# EasyEDA Pro project STM Embedded BD.eprj, board PCB1
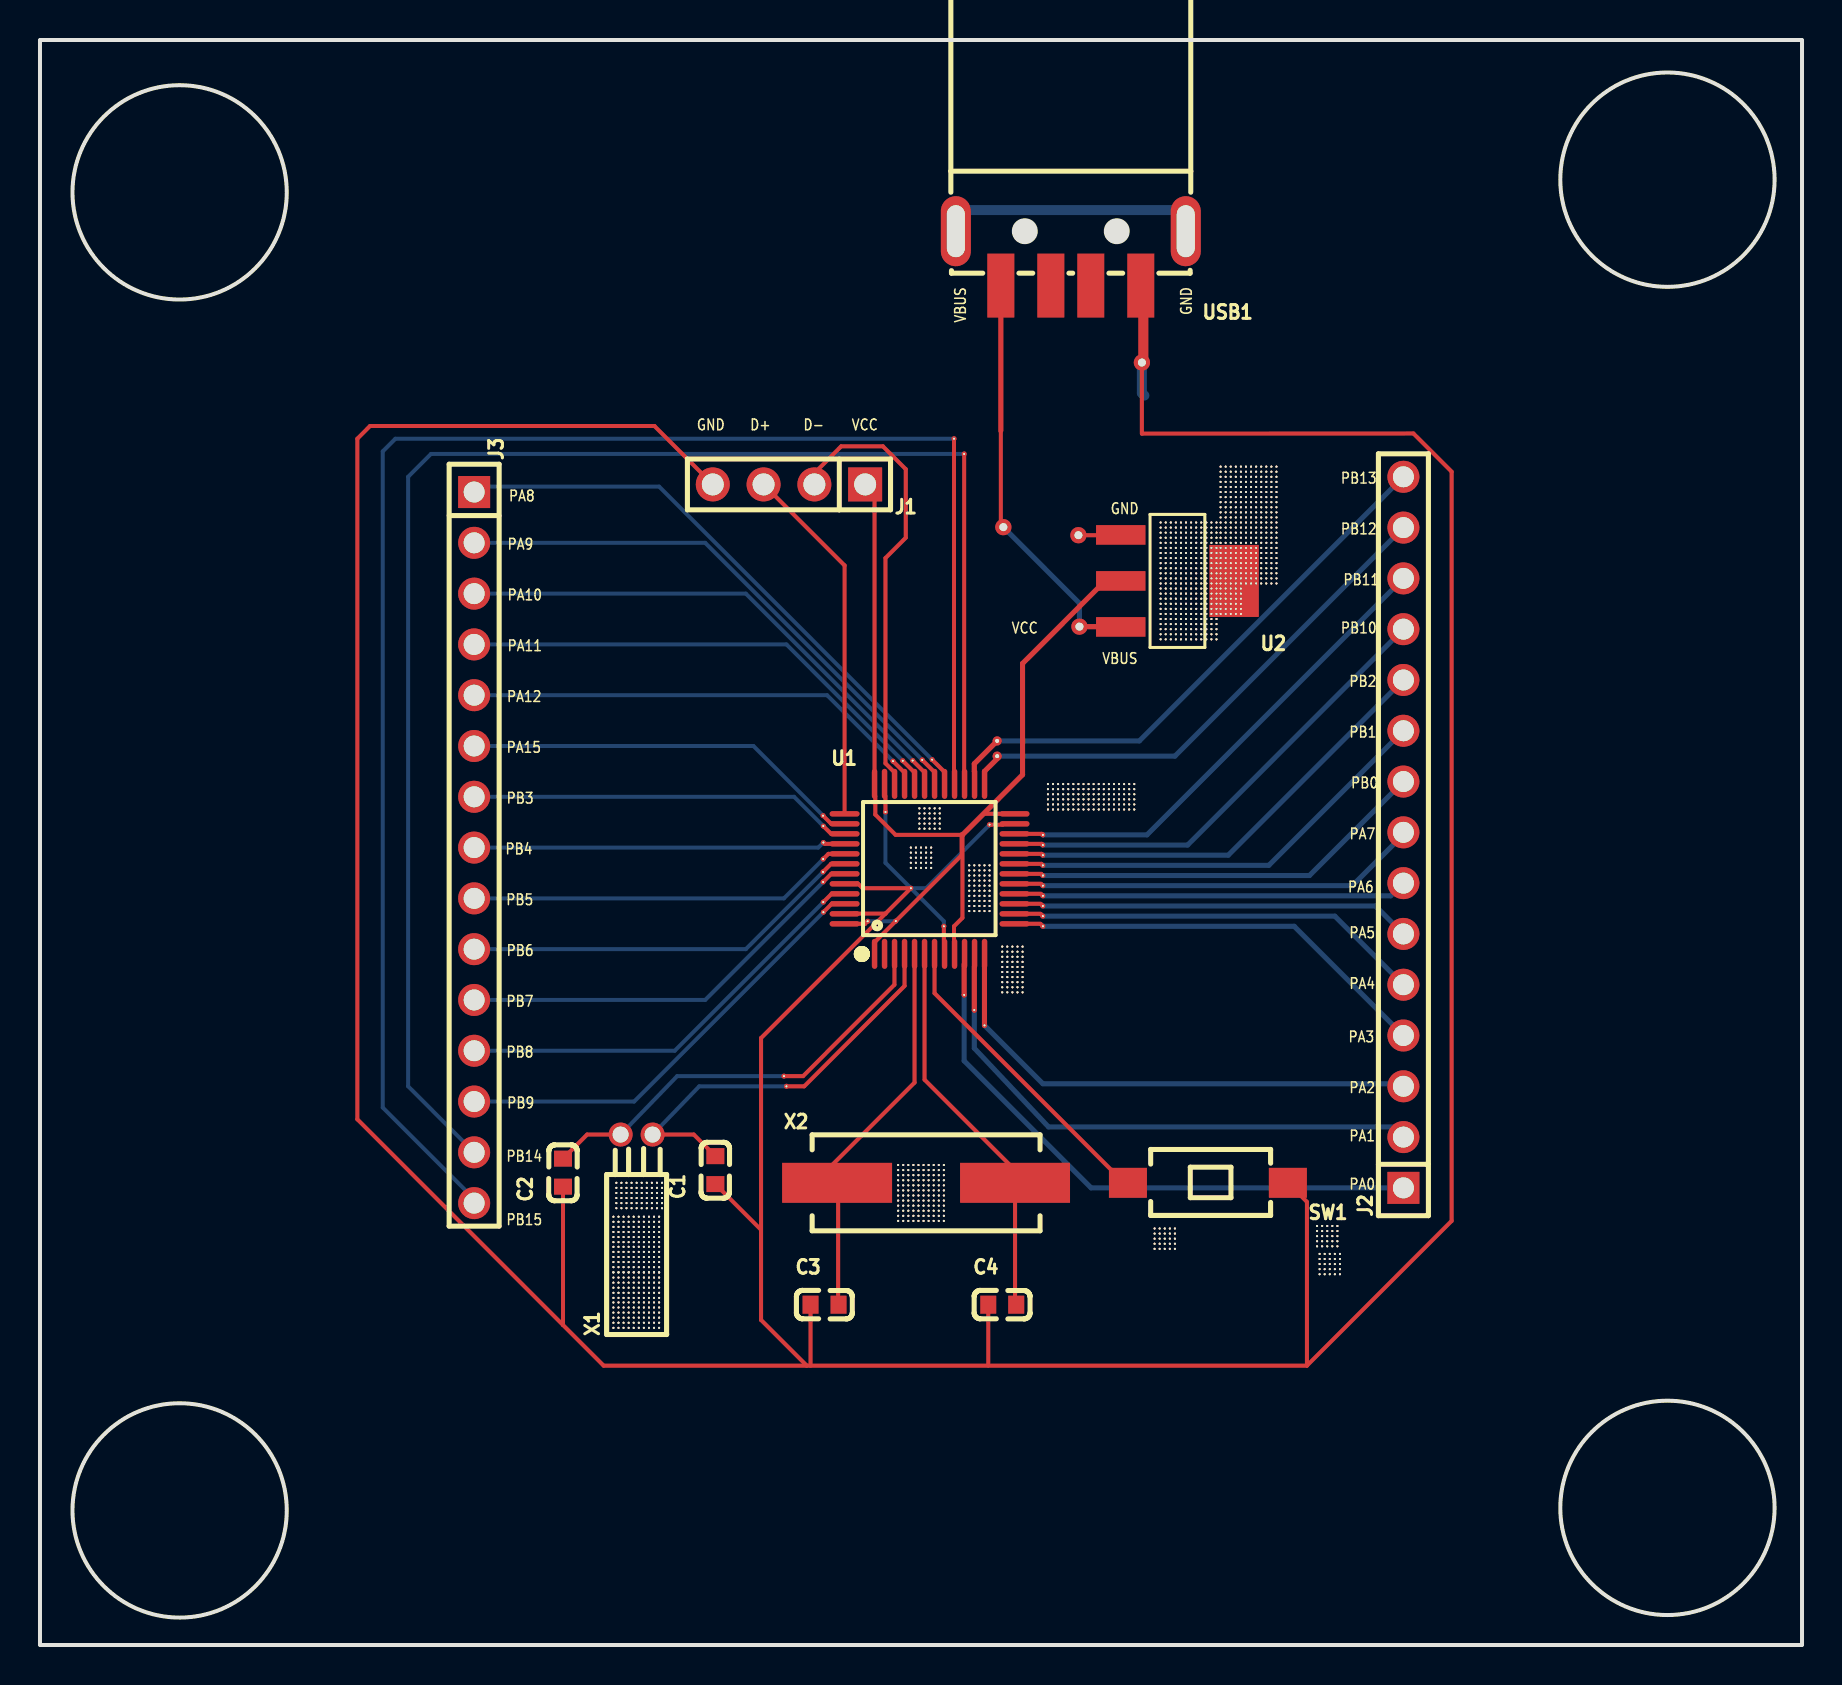
[diagram p2: board, top side]
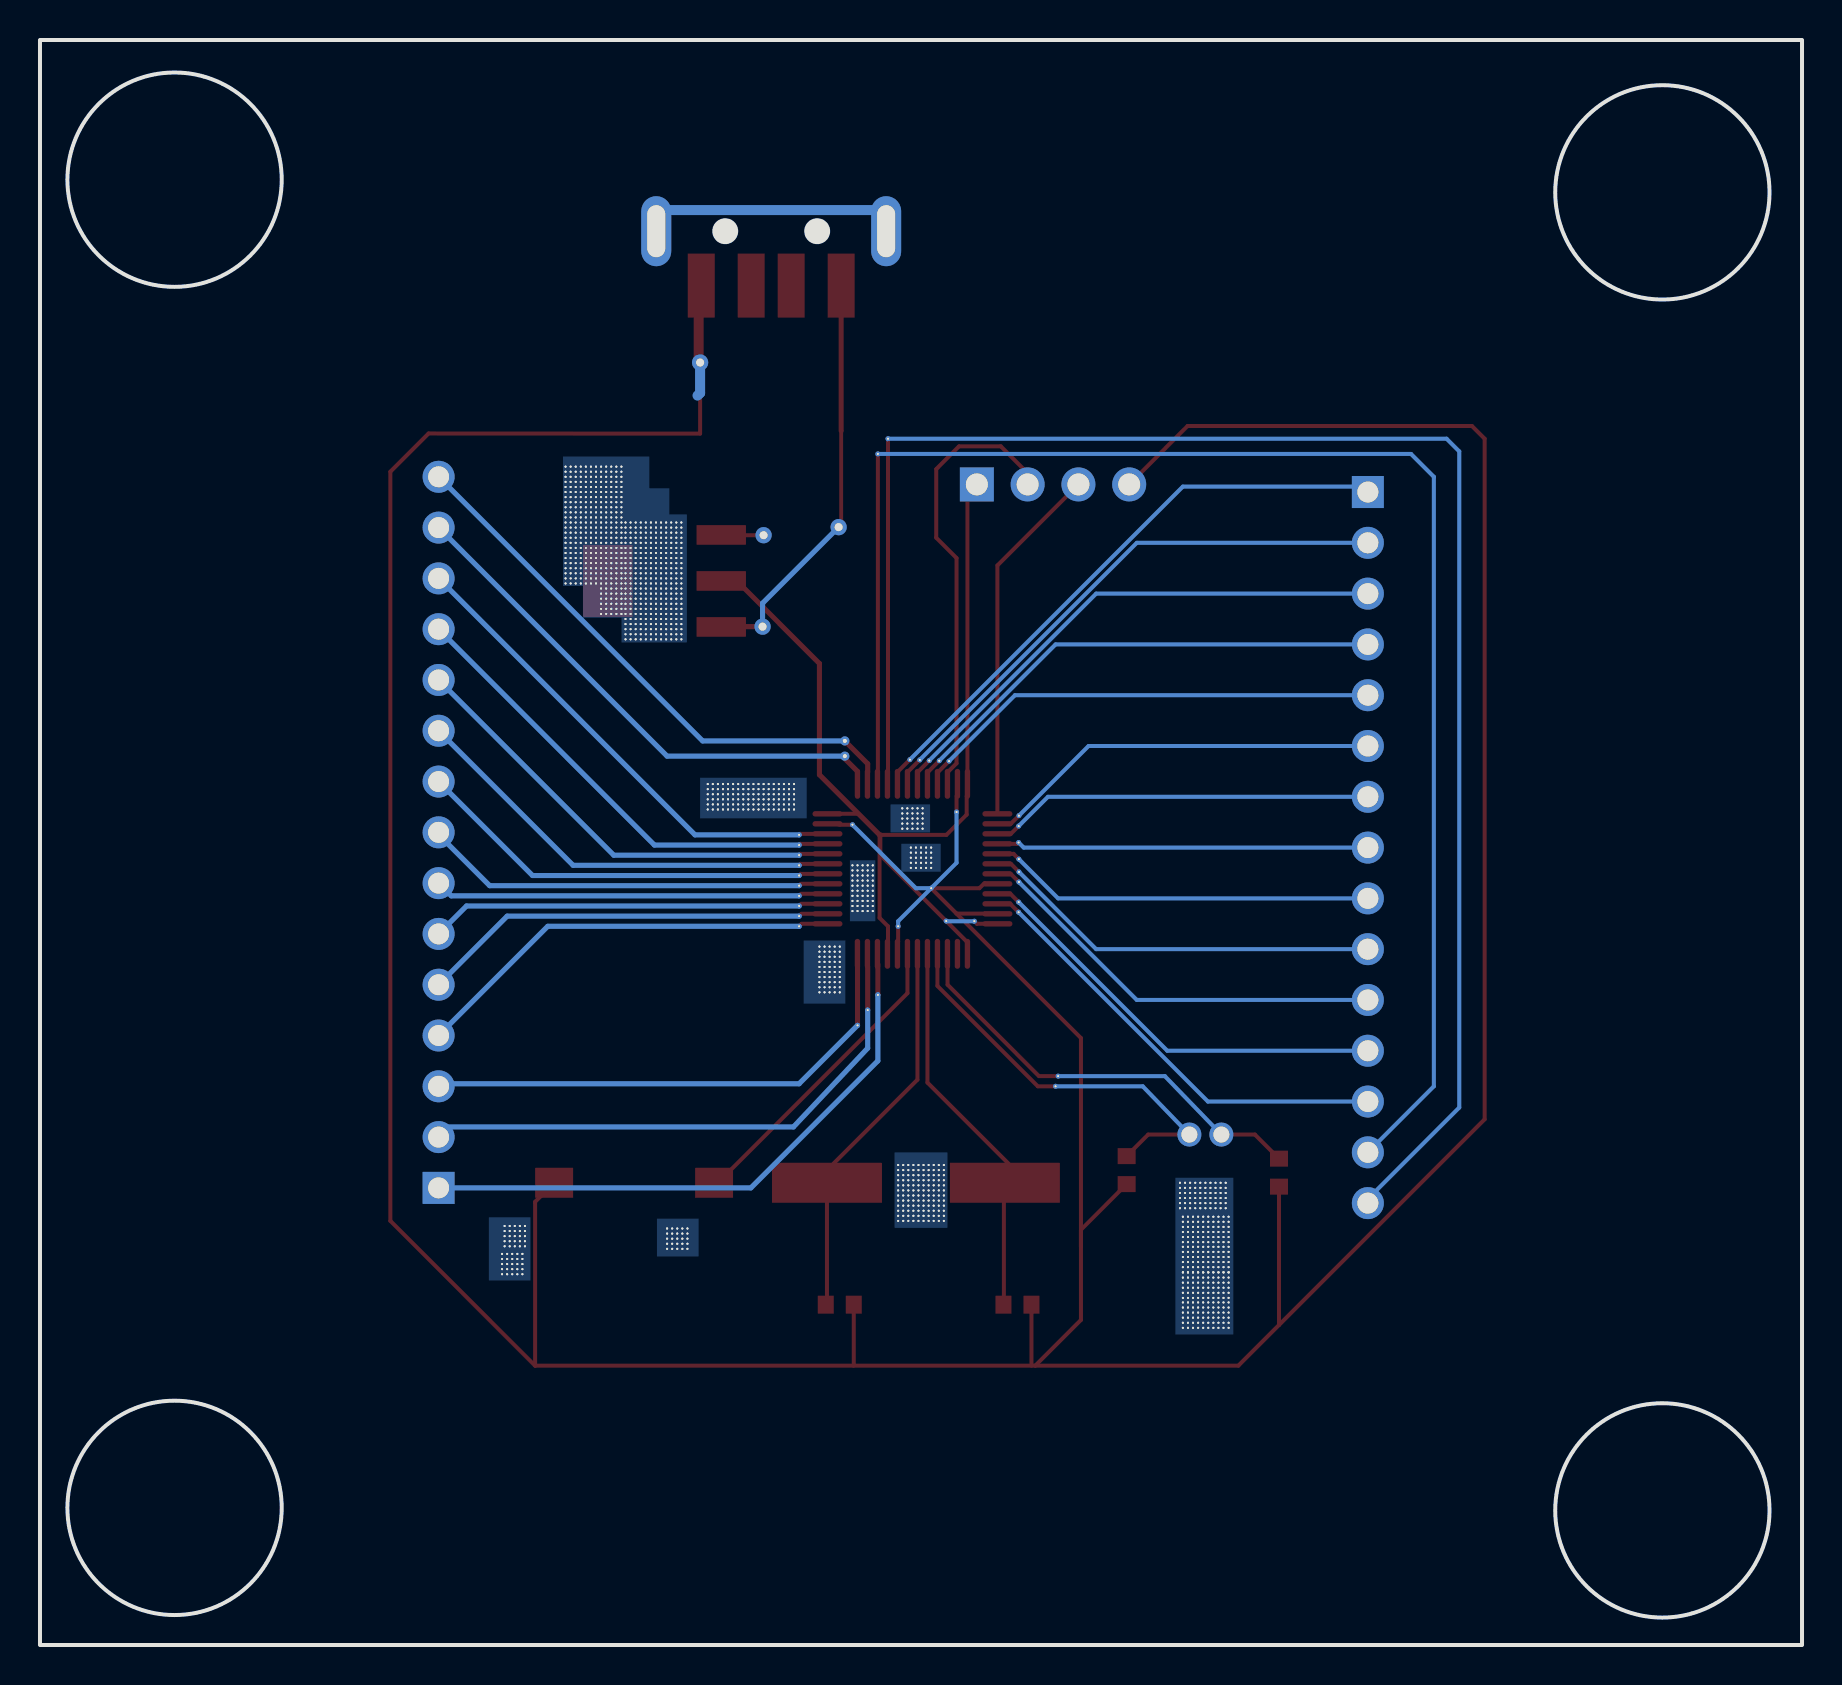
[diagram p3: board, bottom side, seen from below]

Outline 88.14 x 80.26 mm; copper layers: Top Layer, Bottom Layer. Coordinates in mm from the lower left corner of the outline.
Outline path: rectangle 0,80.26 88.14,0 ; circle c6.98,72.64 r5.36 ; circle c6.98,6.73 r5.36 ; circle c81.41,73.28 r5.36 ; circle c81.41,6.86 r5.36
Stack: Top Layer 0.035mm / Dielectric1 1.51mm FR4 er 4.5 / Bottom Layer 0.035mm

## Design rules (mm)
template: JLCPCB Capability(Two Layers Board)
spacing copperThickness1oz (default): track to track 0.102, other pairs 0.152 to 0.3
spacing copperThickness2oz: track to track 0.203, other pairs 0.152 to 0.3
track width copperThickness1oz (default): min 0.127, default 0.254, max 2.54
track width copperThickness2oz: min 0.203, default 0.254, max 2.54
differential pair differentialPair (default): width min 0.127, default 0.254, max 2.54; gap min 0.152, default 0.152
via viaSize (default): diameter min 0.5, default 0.61, max 10; hole min 0.3, default 0.305, max 6.3

## Placement (name value [footprint] x y rotation side)
C1  22pF  [C0603]  33.78 23.75 90 top
C2  22pF  [C0603]  26.16 23.62 90 top
C3  22pF  [C0603]  39.24 17.02 0 top
C4  22pF  [C0603]  48.13 17.02 0 top
J1  PZ254V-11-04P  [HDR-TH_4P-P2.54-V-M]  37.47 58.04 180 top
J2  PZ254-1-15-Z-8.5  [HDR-TH_15P-P2.54-V-M]  68.2 40.64 90 top
J3  PZ254-1-15-Z-8.5  [HDR-TH_15P-P2.54-V-M]  21.72 39.88 270 top
NOREF  -  [Pad_e3040]  48.9 33.65 0 top
NOREF#2  -  [Pad_e1643]  58.85 54.1 0 top
NOREF#3  -  [Pad_e1529]  57.83 50.8 0 top
NOREF#4  -  [Pad_e1618]  56.06 51.31 0 top
NOREF#5  -  [Pad_e2819]  28.94 17.87 0 top
NOREF#6  -  [Pad_e3038]  48.9 33.4 0 top
NOREF#7  -  [Pad_e2812]  29.45 17.36 0 top
NOREF#8  -  [Pad_e2710]  29.7 20.65 0 top
NOREF#9  -  [Pad_e2592]  29.84 22.61 0 top
NOREF#10  -  [Pad_e1918]  59.56 53.59 0 top
NOREF#11  -  [Pad_e1575]  58.85 54.86 0 top
NOREF#12  -  [Pad_e2798]  30.97 18.63 0 top
NOREF#13  -  [Pad_e308]  53.47 42.29 0 top
NOREF#14  -  [Pad_e2768]  29.7 19.91 0 top
NOREF#15  -  [Pad_e1757]  56.82 55.63 0 top
NOREF#16  -  [Pad_e2466]  43.94 23.75 0 top
NOREF#17  -  [Pad_e2609]  30.35 22.35 0 top
NOREF#18  -  [Pad_e1937]  59.31 55.88 0 top
NOREF#19  -  [Pad_e1796]  57.58 52.07 0 top
NOREF#20  -  [Pad_e1688]  58.09 52.83 0 top
NOREF#21  -  [Pad_e1882]  60.58 57.4 0 top
NOREF#22  -  [Pad_e218]  37.34 27.94 0 top
NOREF#23  -  [Pad_e1612]  57.33 50.29 0 top
NOREF#24  -  [Pad_e2715]  29.95 19.91 0 top
NOREF#25  -  [Pad_e3119]  56.01 20.83 0 top
NOREF#26  -  [Pad_e1755]  56.82 55.37 0 top
NOREF#27  -  [Pad_e2459]  43.18 23.24 0 top
NOREF#28  -  [Pad_e2991]  44.5 41.84 0 top
NOREF#29  -  [Pad_e1877]  59.31 57.4 0 top
NOREF#30  -  [Pad_e2566]  28.83 22.86 0 top
NOREF#31  -  [Pad_e2088]  61.85 55.63 0 top
NOREF#32  -  [Pad_e2495]  44.45 22.73 0 top
NOREF#33  -  [Pad_e111]  42.67 44.2 0 top
NOREF#34  -  [Pad_e2427]  59.31 52.32 0 top
NOREF#35  -  [Pad_e3037]  48.13 33.4 0 top
NOREF#36  -  [Pad_e3072]  64.77 18.54 0 top
NOREF#37  -  [Pad_e1720]  58.6 53.59 0 top
NOREF#38  -  [Pad_e1641]  58.85 53.85 0 top
NOREF#39  -  [Pad_e1598]  58.6 54.61 0 top
NOREF#40  -  [Pad_e2553]  44.45 21.46 0 top
NOREF#41  -  [Pad_e2454]  43.43 24 0 top
NOREF#42  -  [Pad_e3012]  48.13 34.67 0 top
NOREF#43  -  [Pad_e1745]  56.31 56.13 0 top
NOREF#44  -  [Pad_e2783]  30.72 17.61 0 top
NOREF#45  -  [Pad_e2066]  60.07 57.66 0 top
NOREF#46  -  [Pad_e1828]  60.83 53.09 0 top
NOREF#47  -  [Pad_e1970]  60.83 55.12 0 top
NOREF#48  -  [Pad_e1703]  56.56 53.85 0 top
NOREF#49  -  [Pad_e2717]  29.95 19.15 0 top
NOREF#50  -  [Pad_e266]  52.45 42.29 0 top
NOREF#51  -  [Pad_e1901]  60.07 53.34 0 top
NOREF#52  -  [Pad_e3018]  48.13 34.92 0 top
NOREF#53  -  [Pad_e2895]  44.58 38.86 0 top
NOREF#54  -  [Pad_e2034]  59.06 58.67 0 top
NOREF#55  -  [Pad_e1963]  59.82 55.63 0 top
NOREF#56  -  [Pad_e1893]  59.56 54.61 0 top
NOREF#57  -  [Pad_e2833]  29.45 17.87 0 top
NOREF#58  -  [Pad_e135]  50.93 42.8 0 top
NOREF#59  -  [Pad_e2491]  44.2 22.99 0 top
NOREF#60  -  [Pad_e1594]  57.58 54.61 0 top
NOREF#61  -  [Pad_e2085]  60.83 54.86 0 top
NOREF#62  -  [Pad_e1921]  59.31 53.34 0 top
NOREF#63  -  [Pad_e1836]  61.85 54.1 0 top
NOREF#64  -  [Pad_e1714]  57.33 53.85 0 top
NOREF#65  -  [Pad_e2800]  30.97 17.87 0 top
NOREF#66  -  [Pad_e2982]  43.99 41.33 0 top
NOREF#67  -  [Pad_e1724]  57.83 54.36 0 top
NOREF#68  -  [Pad_e2723]  30.72 18.9 0 top
NOREF#69  -  [Pad_e2685]  28.68 21.42 0 top
NOREF#70  -  [Pad_e1689]  58.34 52.32 0 top
NOREF#71  -  [Pad_e2615]  30.35 21.84 0 top
NOREF#72  -  [Pad_e248]  53.21 41.78 0 top
NOREF#73  -  [Pad_e18]  51.99 50.93 0 top
NOREF#74  -  [Pad_e2457]  43.18 23.49 0 top
NOREF#75  -  [Pad_e2056]  60.83 57.66 0 top
NOREF#76  -  [Pad_e2844]  30.46 17.13 0 top
NOREF#77  -  [Pad_e1750]  56.31 55.63 0 top
NOREF#78  -  [Pad_e2539]  44.45 22.48 0 top
NOREF#79  -  [Pad_e1633]  56.31 50.55 0 top
NOREF#80  -  [Pad_e1838]  61.85 54.36 0 top
NOREF#81  -  [Pad_e1523]  58.85 50.55 0 top
NOREF#82  -  [Pad_e304]  53.72 42.8 0 top
NOREF#83  -  [Pad_e3068]  63.88 20.95 0 top
NOREF#84  -  [Pad_e1985]  59.31 56.9 0 top
NOREF#85  -  [Pad_e2613]  30.35 22.1 0 top
NOREF#86  -  [Pad_e1748]  56.31 55.37 0 top
NOREF#87  -  [Pad_e3105]  56.77 20.32 0 top
NOREF#88  -  [Pad_e26]  47.88 45.21 0 top
NOREF#89  -  [Pad_e2422]  59.82 51.56 0 top
NOREF#90  -  [Pad_e1971]  60.58 55.37 0 top
NOREF#91  -  [Pad_e2559]  44.96 22.22 0 top
NOREF#92  -  [Pad_e1858]  60.33 58.17 0 top
NOREF#93  -  [Pad_e1629]  56.82 51.05 0 top
NOREF#94  -  [Pad_e2550]  44.2 21.21 0 top
NOREF#95  -  [Pad_e2480]  45.21 22.73 0 top
NOREF#96  -  [Pad_e1646]  57.07 52.07 0 top
NOREF#97  -  [Pad_e3043]  48.13 33.65 0 top
NOREF#98  -  [Pad_e1948]  59.56 55.37 0 top
NOREF#99  -  [Pad_e3005]  49.15 34.42 0 top
NOREF#100  -  [Pad_e3077]  64.01 18.8 0 top
NOREF#101  -  [Pad_e1521]  58.85 50.29 0 top
NOREF#102  -  [Pad_e2855]  30.21 15.86 0 top
NOREF#103  -  [Pad_e1938]  59.06 55.63 0 top
NOREF#104  -  [Pad_e1637]  56.82 50.55 0 top
NOREF#105  -  [Pad_e1532]  57.58 50.8 0 top
NOREF#106  -  [Pad_e2504]  44.7 23.75 0 top
NOREF#107  -  [Pad_e2864]  30.46 16.88 0 top
NOREF#108  -  [Pad_e1791]  58.6 55.37 0 top
NOREF#109  -  [Pad_e2736]  30.97 19.66 0 top
NOREF#110  -  [Pad_e2963]  47.24 38.73 0 top
NOREF#111  -  [Pad_e2744]  30.46 19.66 0 top
NOREF#112  -  [Pad_e2923]  46.48 36.7 0 top
NOREF#113  -  [Pad_e2691]  29.7 20.4 0 top
NOREF#114  -  [Pad_e2763]  28.94 18.9 0 top
NOREF#115  -  [Pad_e2936]  46.74 37.46 0 top
NOREF#116  -  [Pad_e1544]  58.34 50.29 0 top
NOREF#117  -  [Pad_e2946]  46.99 37.97 0 top
NOREF#118  -  [Pad_e1961]  60.33 55.37 0 top
NOREF#119  -  [Pad_e1936]  59.06 55.88 0 top
NOREF#120  -  [Pad_e2067]  61.34 58.93 0 top
NOREF#121  -  [Pad_e1839]  61.59 54.1 0 top
NOREF#122  -  [Pad_e2965]  47.24 38.99 0 top
NOREF#123  -  [Pad_e2604]  30.61 23.11 0 top
NOREF#124  -  [Pad_e2947]  47.24 37.97 0 top
NOREF#125  -  [Pad_e1664]  56.31 52.07 0 top
NOREF#126  -  [Pad_e328]  54.74 42.29 0 top
NOREF#127  -  [Pad_e2969]  46.74 38.99 0 top
NOREF#128  -  [Pad_e2570]  29.84 21.84 0 top
NOREF#129  -  [Pad_e2886]  29.7 16.88 0 top
NOREF#130  -  [Pad_e1878]  59.56 57.4 0 top
NOREF#131  -  [Pad_e252]  51.94 43.05 0 top
NOREF#132  -  [Pad_e2937]  46.48 37.46 0 top
NOREF#133  -  [Pad_e2683]  30.72 20.65 0 top
NOREF#134  -  [Pad_e2931]  46.74 37.21 0 top
NOREF#135  -  [Pad_e1940]  59.31 55.12 0 top
NOREF#136  -  [Pad_e3031]  48.39 33.15 0 top
NOREF#137  -  [Pad_e1566]  57.33 55.88 0 top
NOREF#138  -  [Pad_e2060]  61.09 57.91 0 top
NOREF#139  -  [Pad_e2439]  59.82 52.58 0 top
NOREF#140  -  [Pad_e2571]  29.84 22.1 0 top
NOREF#141  -  [Pad_e1854]  60.33 58.67 0 top
NOREF#142  -  [Pad_e1556]  58.34 51.31 0 top
NOREF#143  -  [Pad_e1870]  60.83 58.67 0 top
NOREF#144  -  [Pad_e256]  52.2 42.29 0 top
NOREF#145  -  [Pad_e1701]  56.56 54.1 0 top
NOREF#146  -  [Pad_e3013]  48.9 34.67 0 top
NOREF#147  -  [Pad_e1624]  56.56 51.56 0 top
NOREF#148  -  [Pad_e2973]  43.99 40.82 0 top
NOREF#149  -  [Pad_e2690]  29.7 20.15 0 top
NOREF#150  -  [Pad_e2574]  29.34 23.11 0 top
NOREF#151  -  [Pad_e1897]  60.58 54.61 0 top
NOREF#152  -  [Pad_e2676]  30.97 21.16 0 top
NOREF#153  -  [Pad_e2753]  29.45 18.9 0 top
NOREF#154  -  [Pad_e2943]  46.48 37.72 0 top
NOREF#155  -  [Pad_e2524]  43.43 21.46 0 top
NOREF#156  -  [Pad_e3110]  56.77 20.57 0 top
NOREF#157  -  [Pad_e207]  42.81 36.2 0 top
NOREF#158  -  [Pad_e1670]  57.07 52.83 0 top
NOREF#159  -  [Pad_e2537]  44.2 21.72 0 top
NOREF#160  -  [Pad_e2846]  30.46 16.37 0 top
NOREF#161  -  [Pad_e1972]  60.83 55.37 0 top
NOREF#162  -  [Pad_e1682]  57.83 52.32 0 top
NOREF#163  -  [Pad_e2656]  29.95 21.16 0 top
NOREF#164  -  [Pad_e2527]  43.69 22.48 0 top
NOREF#165  -  [Pad_e2842]  30.72 15.86 0 top
NOREF#166  -  [Pad_e1562]  57.07 50.8 0 top
NOREF#167  -  [Pad_e2885]  28.94 15.86 0 top
NOREF#168  -  [Pad_e2441]  59.82 52.32 0 top
NOREF#169  -  [Pad_e2061]  61.09 57.66 0 top
NOREF#170  -  [Pad_e2837]  29.95 16.37 0 top
NOREF#171  -  [Pad_e2655]  29.95 21.42 0 top
NOREF#172  -  [Pad_e2510]  43.94 21.21 0 top
NOREF#173  -  [Pad_e309]  53.97 43.05 0 top
NOREF#174  -  [Pad_e2497]  44.96 24 0 top
NOREF#175  -  [Pad_e1871]  60.83 58.17 0 top
NOREF#176  -  [Pad_e1862]  59.82 58.67 0 top
NOREF#177  -  [Pad_e298]  54.48 42.04 0 top
NOREF#178  -  [Pad_e1822]  61.34 54.36 0 top
NOREF#179  -  [Pad_e2496]  45.21 23.75 0 top
NOREF#180  -  [Pad_e2046]  59.56 58.17 0 top
NOREF#181  -  [Pad_e2587]  29.59 23.11 0 top
NOREF#182  -  [Pad_e2961]  46.74 38.73 0 top
NOREF#183  -  [Pad_e1571]  57.07 55.63 0 top
NOREF#184  -  [Pad_e1855]  60.07 58.93 0 top
NOREF#185  -  [Pad_e2431]  59.06 51.82 0 top
NOREF#186  -  [Pad_e285]  52.45 42.04 0 top
NOREF#187  -  [Pad_e2779]  30.21 18.63 0 top
NOREF#188  -  [Pad_e2486]  44.7 23.24 0 top
NOREF#189  -  [Pad_e251]  52.96 41.78 0 top
NOREF#190  -  [Pad_e2694]  29.19 21.42 0 top
NOREF#191  -  [Pad_e2992]  45 41.84 0 top
NOREF#192  -  [Pad_e1776]  57.33 54.86 0 top
NOREF#193  -  [Pad_e2872]  29.45 15.86 0 top
NOREF#194  -  [Pad_e1697]  56.31 54.1 0 top
NOREF#195  -  [Pad_e1657]  56.82 53.09 0 top
NOREF#196  -  [Pad_e1582]  57.83 55.88 0 top
NOREF#197  -  [Pad_e65]  46.23 32.51 0 top
NOREF#198  -  [Pad_e1672]  57.07 52.58 0 top
NOREF#199  -  [Pad_e2499]  44.96 23.75 0 top
NOREF#200  -  [Pad_e2543]  44.96 21.46 0 top
NOREF#201  -  [Pad_e1698]  56.06 53.85 0 top
NOREF#202  -  [Pad_e3091]  64.52 19.56 0 top
NOREF#203  -  [Pad_e2962]  46.48 38.73 0 top
NOREF#204  -  [Pad_e322]  54.23 42.04 0 top
NOREF#205  -  [Pad_e2742]  30.97 19.4 0 top
NOREF#206  -  [Pad_e2529]  43.69 22.22 0 top
NOREF#207  -  [Pad_e1568]  57.33 56.13 0 top
NOREF#208  -  [Pad_e165]  51.18 42.54 0 top
NOREF#209  -  [Pad_e2437]  59.82 52.83 0 top
NOREF#210  -  [Pad_e1707]  56.06 53.34 0 top
NOREF#211  -  [Pad_e214]  50.42 41.78 0 top
NOREF#212  -  [Pad_e302]  53.72 43.05 0 top
NOREF#213  -  [Pad_e1753]  56.82 56.13 0 top
NOREF#214  -  [Pad_e1764]  56.56 55.12 0 top
NOREF#215  -  [Pad_e2780]  30.97 17.36 0 top
NOREF#216  -  [Pad_e321]  53.97 42.04 0 top
NOREF#217  -  [Pad_e1761]  56.31 55.12 0 top
NOREF#218  -  [Pad_e2558]  45.21 22.48 0 top
NOREF#219  -  [Pad_e305]  53.72 42.29 0 top
NOREF#220  -  [Pad_e1708]  56.82 53.34 0 top
NOREF#221  -  [Pad_e2456]  43.43 23.24 0 top
NOREF#222  -  [Pad_e2829]  29.45 18.37 0 top
NOREF#223  -  [Pad_e2782]  30.72 17.36 0 top
NOREF#224  -  [Pad_e1911]  59.06 53.59 0 top
NOREF#225  -  [Pad_e1774]  58.34 55.88 0 top
NOREF#226  -  [Pad_e3061]  64.13 20.7 0 top
NOREF#227  -  [Pad_e1895]  61.59 54.61 0 top
NOREF#228  -  [Pad_e1744]  57.07 55.12 0 top
NOREF#229  -  [Pad_e255]  52.2 42.8 0 top
NOREF#230  -  [Pad_e312]  54.23 42.29 0 top
NOREF#231  -  [Pad_e1690]  58.09 52.58 0 top
NOREF#232  -  [Pad_e2528]  43.94 22.48 0 top
NOREF#233  -  [Pad_e1729]  58.09 54.36 0 top
NOREF#234  -  [Pad_e2956]  46.74 38.48 0 top
NOREF#235  -  [Pad_e2750]  29.7 18.64 0 top
NOREF#236  -  [Pad_e2922]  47.24 36.7 0 top
NOREF#237  -  [Pad_e2825]  28.94 17.36 0 top
NOREF#238  -  [Pad_e2429]  59.31 52.07 0 top
NOREF#239  -  [Pad_e1900]  60.33 53.09 0 top
NOREF#240  -  [Pad_e324]  54.74 42.8 0 top
NOREF#241  -  [Pad_e1675]  56.82 52.83 0 top
NOREF#242  -  [Pad_e1832]  61.34 53.09 0 top
NOREF#243  -  [Pad_e2021]  61.09 56.64 0 top
NOREF#244  -  [Pad_e2460]  42.93 22.73 0 top
NOREF#245  -  [Pad_e3017]  49.15 34.92 0 top
NOREF#246  -  [Pad_e2964]  46.99 38.73 0 top
NOREF#247  -  [Pad_e1769]  57.58 55.12 0 top
NOREF#248  -  [Pad_e1610]  58.34 51.82 0 top
NOREF#249  -  [Pad_e2083]  61.09 55.12 0 top
NOREF#250  -  [Pad_e1640]  57.07 51.56 0 top
NOREF#251  -  [Pad_e2474]  43.43 23.75 0 top
NOREF#252  -  [Pad_e2695]  28.94 21.16 0 top
NOREF#253  -  [Pad_e3114]  56.26 20.57 0 top
NOREF#254  -  [Pad_e1662]  56.56 52.32 0 top
NOREF#255  -  [Pad_e2052]  59.56 57.91 0 top
NOREF#256  -  [Pad_e329]  54.48 42.54 0 top
NOREF#257  -  [Pad_e64]  46.74 31.75 0 top
NOREF#258  -  [Pad_e2718]  29.95 19.4 0 top
NOREF#259  -  [Pad_e223]  51.18 42.04 0 top
NOREF#260  -  [Pad_e2493]  44.45 22.99 0 top
NOREF#261  -  [Pad_e2610]  30.1 21.84 0 top
NOREF#262  -  [Pad_e2027]  61.09 56.39 0 top
NOREF#263  -  [Pad_e293]  52.96 42.54 0 top
NOREF#264  -  [Pad_e2786]  30.46 17.87 0 top
NOREF#265  -  [Pad_e2681]  30.72 20.91 0 top
NOREF#266  -  [Pad_e2043]  59.82 58.17 0 top
NOREF#267  -  [Pad_e3011]  48.39 34.67 0 top
NOREF#268  -  [Pad_e2603]  30.86 22.1 0 top
NOREF#269  -  [Pad_e1952]  59.31 54.86 0 top
NOREF#270  -  [Pad_e2581]  28.83 22.1 0 top
NOREF#271  -  [Pad_e1669]  57.33 53.09 0 top
NOREF#272  -  [Pad_e2589]  29.59 22.86 0 top
NOREF#273  -  [Pad_e2877]  28.94 16.62 0 top
NOREF#274  -  [Pad_e2580]  28.83 21.84 0 top
NOREF#275  -  [Pad_e2984]  44.5 41.33 0 top
NOREF#276  -  [Pad_e1831]  60.58 53.09 0 top
NOREF#277  -  [Pad_e2810]  29.7 17.36 0 top
NOREF#278  -  [Pad_e2827]  29.45 18.63 0 top
NOREF#279  -  [Pad_e2050]  59.06 57.66 0 top
NOREF#280  -  [Pad_e1957]  60.33 55.88 0 top
NOREF#281  -  [Pad_e1742]  58.85 54.36 0 top
NOREF#282  -  [Pad_e253]  52.2 43.05 0 top
NOREF#283  -  [Pad_e1905]  59.31 54.36 0 top
NOREF#284  -  [Pad_e126]  50.67 42.54 0 top
NOREF#285  -  [Pad_e1666]  56.82 52.07 0 top
NOREF#286  -  [Pad_e292]  53.21 42.29 0 top
NOREF#287  -  [Pad_e1579]  57.58 56.13 0 top
NOREF#288  -  [Pad_e1740]  58.34 53.59 0 top
NOREF#289  -  [Pad_e2748]  28.68 19.4 0 top
NOREF#290  -  [Pad_e2623]  30.86 22.35 0 top
NOREF#291  -  [Pad_e3006]  48.39 34.42 0 top
NOREF#292  -  [Pad_e2040]  59.56 58.93 0 top
NOREF#293  -  [Pad_e2704]  29.19 20.4 0 top
NOREF#294  -  [Pad_e101]  51.94 55.5 0 top
NOREF#295  -  [Pad_e2029]  61.09 56.13 0 top
NOREF#296  -  [Pad_e2525]  43.18 21.21 0 top
NOREF#297  -  [Pad_e2777]  29.95 17.87 0 top
NOREF#298  -  [Pad_e2514]  43.43 22.48 0 top
NOREF#299  -  [Pad_e1978]  61.09 55.37 0 top
NOREF#300  -  [Pad_e2661]  30.97 20.4 0 top
NOREF#301  -  [Pad_e2738]  30.97 19.91 0 top
NOREF#302  -  [Pad_e313]  53.97 42.54 0 top
NOREF#303  -  [Pad_e2664]  30.46 21.42 0 top
NOREF#304  -  [Pad_e208]  50.67 42.04 0 top
NOREF#305  -  [Pad_e249]  52.96 42.04 0 top
NOREF#306  -  [Pad_e1805]  58.6 52.58 0 top
NOREF#307  -  [Pad_e123]  50.67 42.8 0 top
NOREF#308  -  [Pad_e1679]  57.83 53.09 0 top
NOREF#309  -  [Pad_e219]  51.18 41.78 0 top
NOREF#310  -  [Pad_e2014]  60.58 56.9 0 top
NOREF#311  -  [Pad_e2696]  29.19 20.65 0 top
NOREF#312  -  [Pad_e3076]  64.26 18.8 0 top
NOREF#313  -  [Pad_e1551]  58.6 51.31 0 top
NOREF#314  -  [Pad_e3118]  55.75 20.83 0 top
NOREF#315  -  [Pad_e2714]  29.19 21.16 0 top
NOREF#316  -  [Pad_e1684]  57.83 52.58 0 top
NOREF#317  -  [Pad_e2930]  47.5 37.21 0 top
NOREF#318  -  [Pad_e2949]  46.74 37.97 0 top
NOREF#319  -  [Pad_e2614]  30.61 22.1 0 top
NOREF#320  -  [Pad_e2747]  28.68 19.15 0 top
NOREF#321  -  [Pad_e2053]  61.09 58.67 0 top
NOREF#322  -  [Pad_e326]  54.74 43.05 0 top
NOREF#323  -  [Pad_e2887]  29.45 17.13 0 top
NOREF#324  -  [Pad_e2607]  30.35 22.61 0 top
NOREF#325  -  [Pad_e1743]  56.06 56.13 0 top
NOREF#326  -  [Pad_e2425]  59.31 52.58 0 top
NOREF#327  -  [Pad_e1812]  61.59 53.09 0 top
NOREF#328  -  [Pad_e1619]  56.31 51.31 0 top
NOREF#329  -  [Pad_e2917]  44.58 39.88 0 top
NOREF#330  -  [Pad_e1526]  57.83 51.56 0 top
NOREF#331  -  [Pad_e2079]  61.59 58.17 0 top
NOREF#332  -  [Pad_e1869]  60.58 58.67 0 top
NOREF#333  -  [Pad_e300]  54.48 41.78 0 top
NOREF#334  -  [Pad_e1555]  58.6 50.8 0 top
NOREF#335  -  [Pad_e3055]  64.9 20.45 0 top
NOREF#336  -  [Pad_e1926]  59.56 53.09 0 top
NOREF#337  -  [Pad_e3065]  64.64 20.95 0 top
NOREF#338  -  [Pad_e2019]  61.09 56.9 0 top
NOREF#339  -  [Pad_e48]  50.16 36.96 0 top
NOREF#340  -  [Pad_e1525]  57.58 51.56 0 top
NOREF#341  -  [Pad_e2976]  44.24 41.08 0 top
NOREF#342  -  [Pad_e2075]  61.59 58.67 0 top
NOREF#343  -  [Pad_e2588]  29.84 23.11 0 top
NOREF#344  -  [Pad_e2699]  28.94 20.65 0 top
NOREF#345  -  [Pad_e263]  52.71 42.29 0 top
NOREF#346  -  [Pad_e1567]  57.07 56.13 0 top
NOREF#347  -  [Pad_e1960]  60.07 55.37 0 top
NOREF#348  -  [Pad_e118]  39.18 37.15 0 top
NOREF#349  -  [Pad_e3090]  64.77 19.56 0 top
NOREF#350  -  [Pad_e1655]  56.06 52.32 0 top
NOREF#351  -  [Pad_e2434]  59.56 51.82 0 top
NOREF#352  -  [Pad_e2960]  47.5 38.73 0 top
NOREF#353  -  [Pad_e2032]  60.07 57.91 0 top
NOREF#354  -  [Pad_e2757]  28.94 19.4 0 top
NOREF#355  -  [Pad_e1991]  59.56 56.64 0 top
NOREF#356  -  [Pad_e3117]  56.77 20.83 0 top
NOREF#357  -  [Pad_e295]  52.96 42.29 0 top
NOREF#358  -  [Pad_e2624]  30.61 22.86 0 top
NOREF#359  -  [Pad_e3002]  48.13 34.16 0 top
NOREF#360  -  [Pad_e2005]  60.07 56.64 0 top
NOREF#361  -  [Pad_e2470]  43.94 23.24 0 top
NOREF#362  -  [Pad_e287]  52.45 41.78 0 top
NOREF#363  -  [Pad_e1920]  59.06 53.34 0 top
NOREF#364  -  [Pad_e303]  53.47 42.8 0 top
NOREF#365  -  [Pad_e1946]  59.56 55.63 0 top
NOREF#366  -  [Pad_e2575]  29.08 22.86 0 top
NOREF#367  -  [Pad_e2933]  47.24 37.21 0 top
NOREF#368  -  [Pad_e1648]  56.06 53.09 0 top
NOREF#369  -  [Pad_e2006]  59.82 57.15 0 top
NOREF#370  -  [Pad_e2807]  28.68 17.87 0 top
NOREF#371  -  [Pad_e2920]  47.5 36.7 0 top
NOREF#372  -  [Pad_e1608]  57.83 51.82 0 top
NOREF#373  -  [Pad_e2010]  61.59 56.13 0 top
NOREF#374  -  [Pad_e238]  51.69 42.54 0 top
NOREF#375  -  [Pad_e125]  50.42 42.54 0 top
NOREF#376  -  [Pad_e1553]  58.6 51.05 0 top
NOREF#377  -  [Pad_e1599]  58.85 54.61 0 top
NOREF#378  -  [Pad_e2739]  30.72 19.66 0 top
NOREF#379  -  [Pad_e2622]  31.12 22.61 0 top
NOREF#380  -  [Pad_e1886]  61.59 57.4 0 top
NOREF#381  -  [Pad_e2586]  29.84 22.86 0 top
NOREF#382  -  [Pad_e1868]  60.83 58.93 0 top
NOREF#383  -  [Pad_e2908]  44.32 39.37 0 top
NOREF#384  -  [Pad_e2888]  29.7 17.13 0 top
NOREF#385  -  [Pad_e1966]  60.58 55.88 0 top
NOREF#386  -  [Pad_e1807]  58.6 52.32 0 top
NOREF#387  -  [Pad_e1709]  56.56 53.59 0 top
NOREF#388  -  [Pad_e2606]  30.61 22.35 0 top
NOREF#389  -  [Pad_e2734]  30.46 18.9 0 top
NOREF#390  -  [Pad_e2959]  46.99 38.48 0 top
NOREF#391  -  [Pad_e1762]  56.06 54.86 0 top
NOREF#392  -  [Pad_e50]  50.16 35.94 0 top
NOREF#393  -  [Pad_e3028]  48.64 32.89 0 top
NOREF#394  -  [Pad_e1589]  56.31 54.61 0 top
NOREF#395  -  [Pad_e2755]  28.94 19.66 0 top
NOREF#396  -  [Pad_e1798]  58.09 52.07 0 top
NOREF#397  -  [Pad_e3085]  65.02 19.3 0 top
NOREF#398  -  [Pad_e3052]  63.88 20.19 0 top
NOREF#399  -  [Pad_e3007]  48.13 34.42 0 top
NOREF#400  -  [Pad_e2502]  45.21 23.49 0 top
NOREF#401  -  [Pad_e1932]  61.59 56.64 0 top
NOREF#402  -  [Pad_e2972]  44.75 40.82 0 top
NOREF#403  -  [Pad_e2048]  59.06 57.91 0 top
NOREF#404  -  [Pad_e2028]  61.34 56.39 0 top
NOREF#405  -  [Pad_e1751]  56.06 55.37 0 top
NOREF#406  -  [Pad_e1935]  60.33 54.86 0 top
NOREF#407  -  [Pad_e2868]  28.68 16.62 0 top
NOREF#408  -  [Pad_e3092]  65.02 19.56 0 top
NOREF#409  -  [Pad_e1737]  57.58 53.34 0 top
NOREF#410  -  [Pad_e2675]  30.21 20.15 0 top
NOREF#411  -  [Pad_e2934]  46.99 37.21 0 top
NOREF#412  -  [Pad_e1856]  60.33 58.93 0 top
NOREF#413  -  [Pad_e2999]  48.39 33.91 0 top
NOREF#414  -  [Pad_e2421]  60.07 51.82 0 top
NOREF#415  -  [Pad_e1584]  57.58 55.63 0 top
NOREF#416  -  [Pad_e1694]  56.31 54.36 0 top
NOREF#417  -  [Pad_e2749]  28.94 19.91 0 top
NOREF#418  -  [Pad_e2809]  28.94 18.63 0 top
NOREF#419  -  [Pad_e2443]  59.82 52.07 0 top
NOREF#420  -  [Pad_e2590]  29.84 22.35 0 top
NOREF#421  -  [Pad_e2816]  29.19 17.87 0 top
NOREF#422  -  [Pad_e3015]  48.9 34.92 0 top
NOREF#423  -  [Pad_e2891]  29.45 16.62 0 top
NOREF#424  -  [Pad_e1817]  60.83 53.59 0 top
NOREF#425  -  [Pad_e1533]  58.09 51.56 0 top
NOREF#426  -  [Pad_e2787]  30.21 18.12 0 top
NOREF#427  -  [Pad_e1613]  57.07 50.55 0 top
NOREF#428  -  [Pad_e2433]  59.31 51.82 0 top
NOREF#429  -  [Pad_e2442]  60.07 52.32 0 top
NOREF#430  -  [Pad_e1773]  58.09 54.86 0 top
NOREF#431  -  [Pad_e1835]  61.09 53.09 0 top
NOREF#432  -  [Pad_e3019]  48.39 34.92 0 top
NOREF#433  -  [Pad_e1992]  59.31 56.13 0 top
NOREF#434  -  [Pad_e1850]  60.07 53.59 0 top
NOREF#435  -  [Pad_e2472]  43.94 23.49 0 top
NOREF#436  -  [Pad_e1904]  59.06 54.36 0 top
NOREF#437  -  [Pad_e260]  52.45 43.05 0 top
NOREF#438  -  [Pad_e1713]  57.07 54.36 0 top
NOREF#439  -  [Pad_e1942]  59.31 55.37 0 top
NOREF#440  -  [Pad_e1910]  59.31 53.85 0 top
NOREF#441  -  [Pad_e264]  52.45 42.54 0 top
NOREF#442  -  [Pad_e1881]  60.33 57.4 0 top
NOREF#443  -  [Pad_e325]  54.48 43.05 0 top
NOREF#444  -  [Pad_e277]  52.2 42.04 0 top
NOREF#445  -  [Pad_e2921]  46.99 36.7 0 top
NOREF#446  -  [Pad_e1524]  58.6 50.29 0 top
NOREF#447  -  [Pad_e2848]  30.46 16.62 0 top
NOREF#448  -  [Pad_e3022]  48.9 32.64 0 top
NOREF#449  -  [Pad_e2863]  30.72 16.37 0 top
NOREF#450  -  [Pad_e2881]  28.68 16.11 0 top
NOREF#451  -  [Pad_e2453]  43.69 22.99 0 top
NOREF#452  -  [Pad_e3101]  56.01 20.07 0 top
NOREF#453  -  [Pad_e2924]  46.74 36.7 0 top
NOREF#454  -  [Pad_e2913]  44.32 39.62 0 top
NOREF#455  -  [Pad_e2950]  47.5 38.23 0 top
NOREF#456  -  [Pad_e2789]  30.21 17.87 0 top
NOREF#457  -  [Pad_e3047]  64.64 19.94 0 top
NOREF#458  -  [Pad_e1634]  56.06 50.29 0 top
NOREF#459  -  [Pad_e2573]  29.59 22.1 0 top
NOREF#460  -  [Pad_e2025]  60.58 56.13 0 top
NOREF#461  -  [Pad_e3080]  65.02 19.05 0 top
NOREF#462  -  [Pad_e3108]  56.52 20.32 0 top
NOREF#463  -  [Pad_e3100]  56.77 20.07 0 top
NOREF#464  -  [Pad_e1588]  56.06 54.61 0 top
NOREF#465  -  [Pad_e2076]  61.85 58.17 0 top
NOREF#466  -  [Pad_e1801]  58.6 53.09 0 top
NOREF#467  -  [Pad_e2902]  43.56 39.12 0 top
NOREF#468  -  [Pad_e1941]  59.06 55.37 0 top
NOREF#469  -  [Pad_e119]  39.19 36.65 0 top
NOREF#470  -  [Pad_e2011]  60.58 57.15 0 top
NOREF#471  -  [Pad_e3048]  63.88 19.94 0 top
NOREF#472  -  [Pad_e2018]  61.34 56.64 0 top
NOREF#473  -  [Pad_e2568]  28.83 22.61 0 top
NOREF#474  -  [Pad_e3094]  64.26 19.56 0 top
NOREF#475  -  [Pad_e2806]  28.68 18.37 0 top
NOREF#476  -  [Pad_e301]  53.47 43.05 0 top
NOREF#477  -  [Pad_e2938]  47.24 37.46 0 top
NOREF#478  -  [Pad_e2896]  44.07 38.86 0 top
NOREF#479  -  [Pad_e254]  51.94 42.8 0 top
NOREF#480  -  [Pad_e2073]  61.59 58.93 0 top
NOREF#481  -  [Pad_e1787]  58.6 55.88 0 top
NOREF#482  -  [Pad_e2716]  29.95 19.66 0 top
NOREF#483  -  [Pad_e2689]  28.94 21.42 0 top
NOREF#484  -  [Pad_e2794]  30.46 17.61 0 top
NOREF#485  -  [Pad_e1665]  56.56 52.07 0 top
NOREF#486  -  [Pad_e2008]  61.59 56.39 0 top
NOREF#487  -  [Pad_e276]  51.94 42.04 0 top
NOREF#488  -  [Pad_e2563]  44.96 21.72 0 top
NOREF#489  -  [Pad_e2533]  43.69 21.72 0 top
NOREF#490  -  [Pad_e1804]  58.85 52.32 0 top
NOREF#491  -  [Pad_e2595]  30.1 23.11 0 top
NOREF#492  -  [Pad_e2853]  30.21 16.11 0 top
NOREF#493  -  [Pad_e2967]  47.5 38.99 0 top
NOREF#494  -  [Pad_e2909]  44.07 39.37 0 top
NOREF#495  -  [Pad_e28]  47.88 44.45 0 top
NOREF#496  -  [Pad_e2803]  30.72 17.87 0 top
NOREF#497  -  [Pad_e2955]  47.5 38.48 0 top
NOREF#498  -  [Pad_e1810]  61.59 53.34 0 top
NOREF#499  -  [Pad_e1887]  61.85 57.4 0 top
NOREF#500  -  [Pad_e2904]  44.32 39.12 0 top
NOREF#501  -  [Pad_e2770]  29.7 19.15 0 top
NOREF#502  -  [Pad_e2797]  30.72 18.63 0 top
NOREF#503  -  [Pad_e2980]  45 41.33 0 top
NOREF#504  -  [Pad_e2841]  30.97 16.11 0 top
NOREF#505  -  [Pad_e2540]  45.21 21.21 0 top
NOREF#506  -  [Pad_e1623]  56.06 50.8 0 top
NOREF#507  -  [Pad_e2611]  30.1 22.1 0 top
NOREF#508  -  [Pad_e3083]  64.77 19.05 0 top
NOREF#509  -  [Pad_e2935]  47.5 37.46 0 top
NOREF#510  -  [Pad_e3020]  49.15 32.64 0 top
NOREF#511  -  [Pad_e2966]  46.99 38.99 0 top
NOREF#512  -  [Pad_e2840]  30.97 15.86 0 top
NOREF#513  -  [Pad_e1923]  59.82 53.09 0 top
NOREF#514  -  [Pad_e1732]  58.34 54.1 0 top
NOREF#515  -  [Pad_e2670]  29.95 20.15 0 top
NOREF#516  -  [Pad_e2843]  30.72 16.11 0 top
NOREF#517  -  [Pad_e1593]  57.33 54.61 0 top
NOREF#518  -  [Pad_e2557]  44.96 22.48 0 top
NOREF#519  -  [Pad_e1564]  56.82 55.12 0 top
NOREF#520  -  [Pad_e2517]  43.18 21.97 0 top
NOREF#521  -  [Pad_e2505]  42.93 22.48 0 top
NOREF#522  -  [Pad_e1896]  60.83 54.61 0 top
NOREF#523  -  [Pad_e2851]  29.95 16.11 0 top
NOREF#524  -  [Pad_e2562]  45.21 21.97 0 top
NOREF#525  -  [Pad_e1982]  59.31 57.15 0 top
NOREF#526  -  [Pad_e1903]  60.07 53.09 0 top
NOREF#527  -  [Pad_e2548]  44.7 21.97 0 top
NOREF#528  -  [Pad_e3032]  48.13 33.15 0 top
NOREF#529  -  [Pad_e1645]  58.34 54.36 0 top
NOREF#530  -  [Pad_e1722]  58.6 53.34 0 top
NOREF#531  -  [Pad_e2914]  44.07 39.62 0 top
NOREF#532  -  [Pad_e2929]  47.24 36.96 0 top
NOREF#533  -  [Pad_e2883]  28.94 16.11 0 top
NOREF#534  -  [Pad_e1658]  56.56 52.83 0 top
NOREF#535  -  [Pad_e250]  53.21 42.04 0 top
NOREF#536  -  [Pad_e1794]  57.33 53.59 0 top
NOREF#537  -  [Pad_e1758]  56.56 55.37 0 top
NOREF#538  -  [Pad_e3064]  64.39 20.7 0 top
NOREF#539  -  [Pad_e1597]  58.34 54.61 0 top
NOREF#540  -  [Pad_e2733]  30.21 18.9 0 top
NOREF#541  -  [Pad_e1756]  56.56 55.63 0 top
NOREF#542  -  [Pad_e1546]  58.34 50.55 0 top
NOREF#543  -  [Pad_e2512]  43.69 21.21 0 top
NOREF#544  -  [Pad_e2970]  45 40.82 0 top
NOREF#545  -  [Pad_e2741]  30.72 19.4 0 top
NOREF#546  -  [Pad_e2552]  44.7 21.21 0 top
NOREF#547  -  [Pad_e1535]  58.09 51.31 0 top
NOREF#548  -  [Pad_e318]  53.72 42.04 0 top
NOREF#549  -  [Pad_e2023]  60.58 56.39 0 top
NOREF#550  -  [Pad_e1576]  58.6 55.12 0 top
NOREF#551  -  [Pad_e2445]  42.93 24 0 top
NOREF#552  -  [Pad_e2773]  29.45 19.15 0 top
NOREF#553  -  [Pad_e2565]  28.83 23.11 0 top
NOREF#554  -  [Pad_e2488]  44.7 23.49 0 top
NOREF#555  -  [Pad_e1700]  56.82 53.85 0 top
NOREF#556  -  [Pad_e2045]  59.82 58.42 0 top
NOREF#557  -  [Pad_e1969]  60.83 55.63 0 top
NOREF#558  -  [Pad_e1859]  60.07 58.42 0 top
NOREF#559  -  [Pad_e1685]  57.58 52.32 0 top
NOREF#560  -  [Pad_e2096]  61.34 55.63 0 top
NOREF#561  -  [Pad_e1767]  58.09 55.37 0 top
NOREF#562  -  [Pad_e1557]  57.33 51.56 0 top
NOREF#563  -  [Pad_e1834]  61.34 53.34 0 top
NOREF#564  -  [Pad_e1983]  59.31 56.64 0 top
NOREF#565  -  [Pad_e2814]  29.19 18.63 0 top
NOREF#566  -  [Pad_e1827]  61.09 53.59 0 top
NOREF#567  -  [Pad_e108]  44.13 44.26 0 top
NOREF#568  -  [Pad_e3058]  64.64 20.45 0 top
NOREF#569  -  [Pad_e2485]  44.45 23.75 0 top
NOREF#570  -  [Pad_e2745]  28.68 19.91 0 top
NOREF#571  -  [Pad_e1841]  61.59 53.85 0 top
NOREF#572  -  [Pad_e1845]  60.33 54.36 0 top
NOREF#573  -  [Pad_e1874]  60.58 58.17 0 top
NOREF#574  -  [Pad_e2009]  61.85 56.39 0 top
NOREF#575  -  [Pad_e2002]  60.33 56.64 0 top
NOREF#576  -  [Pad_e2519]  43.18 21.72 0 top
NOREF#577  -  [Pad_e1638]  56.56 50.29 0 top
NOREF#578  -  [Pad_e1611]  58.09 51.82 0 top
NOREF#579  -  [Pad_e1592]  57.07 54.61 0 top
NOREF#580  -  [Pad_e3016]  48.64 34.92 0 top
NOREF#581  -  [Pad_e1721]  58.85 53.59 0 top
NOREF#582  -  [Pad_e2080]  60.33 56.13 0 top
NOREF#583  -  [Pad_e2673]  30.21 20.4 0 top
NOREF#584  -  [Pad_e3081]  64.26 19.05 0 top
NOREF#585  -  [Pad_e2582]  29.34 21.84 0 top
NOREF#586  -  [Pad_e2541]  45.21 21.46 0 top
NOREF#587  -  [Pad_e290]  53.21 43.05 0 top
NOREF#588  -  [Pad_e3098]  55.75 19.81 0 top
NOREF#589  -  [Pad_e2516]  43.43 21.72 0 top
NOREF#590  -  [Pad_e1977]  61.34 55.12 0 top
NOREF#591  -  [Pad_e2420]  60.07 51.56 0 top
NOREF#592  -  [Pad_e2033]  59.31 58.93 0 top
NOREF#593  -  [Pad_e2728]  30.46 19.4 0 top
NOREF#594  -  [Pad_e2916]  44.07 39.88 0 top
NOREF#595  -  [Pad_e1929]  61.85 56.64 0 top
NOREF#596  -  [Pad_e331]  54.48 42.29 0 top
NOREF#597  -  [Pad_e2912]  43.56 39.62 0 top
NOREF#598  -  [Pad_e2487]  44.45 23.49 0 top
NOREF#599  -  [Pad_e2774]  29.19 19.66 0 top
NOREF#600  -  [Pad_e2616]  31.12 22.86 0 top
NOREF#601  -  [Pad_e332]  54.23 42.8 0 top
NOREF#602  -  [Pad_e1601]  57.07 51.82 0 top
NOREF#603  -  [Pad_e2086]  61.09 54.86 0 top
NOREF#604  -  [Pad_e1967]  60.83 55.88 0 top
NOREF#605  -  [Pad_e2530]  43.94 21.72 0 top
NOREF#606  -  [Pad_e2440]  60.07 52.07 0 top
NOREF#607  -  [Pad_e3066]  64.39 20.95 0 top
NOREF#608  -  [Pad_e294]  53.21 42.54 0 top
NOREF#609  -  [Pad_e3045]  64.9 19.94 0 top
NOREF#610  -  [Pad_e1956]  60.07 55.88 0 top
NOREF#611  -  [Pad_e1677]  58.85 52.07 0 top
NOREF#612  -  [Pad_e2813]  29.45 17.61 0 top
NOREF#613  -  [Pad_e2672]  30.46 20.15 0 top
NOREF#614  -  [Pad_e2449]  43.18 24 0 top
NOREF#615  -  [Pad_e2081]  60.07 56.39 0 top
NOREF#616  -  [Pad_e3033]  48.9 33.15 0 top
NOREF#617  -  [Pad_e1559]  57.33 50.8 0 top
NOREF#618  -  [Pad_e236]  51.69 42.29 0 top
NOREF#619  -  [Pad_e1735]  57.58 53.59 0 top
NOREF#620  -  [Pad_e1586]  57.58 55.37 0 top
NOREF#621  -  [Pad_e2481]  45.21 22.99 0 top
NOREF#622  -  [Pad_e1902]  60.33 53.34 0 top
NOREF#623  -  [Pad_e2057]  60.58 57.91 0 top
NOREF#624  -  [Pad_e1578]  58.6 54.86 0 top
NOREF#625  -  [Pad_e2668]  30.46 20.91 0 top
NOREF#626  -  [Pad_e3039]  48.64 33.4 0 top
NOREF#627  -  [Pad_e2859]  30.72 16.88 0 top
NOREF#628  -  [Pad_e3042]  49.15 33.65 0 top
NOREF#629  -  [Pad_e1915]  59.82 53.59 0 top
NOREF#630  -  [Pad_e2915]  44.32 39.88 0 top
NOREF#631  -  [Pad_e2577]  29.08 22.61 0 top
NOREF#632  -  [Pad_e1770]  57.83 55.12 0 top
NOREF#633  -  [Pad_e1731]  58.09 54.1 0 top
NOREF#634  -  [Pad_e1674]  57.07 52.32 0 top
NOREF#635  -  [Pad_e1806]  58.85 52.58 0 top
NOREF#636  -  [Pad_e2688]  28.68 20.91 0 top
NOREF#637  -  [Pad_e320]  54.23 41.78 0 top
NOREF#638  -  [Pad_e1853]  59.56 57.66 0 top
NOREF#639  -  [Pad_e2498]  45.21 24 0 top
NOREF#640  -  [Pad_e1802]  58.85 53.09 0 top
NOREF#641  -  [Pad_e1591]  56.82 54.61 0 top
NOREF#642  -  [Pad_e1651]  56.31 52.83 0 top
NOREF#643  -  [Pad_e2732]  30.46 18.64 0 top
NOREF#644  -  [Pad_e1739]  58.09 53.59 0 top
NOREF#645  -  [Pad_e1699]  56.56 54.36 0 top
NOREF#646  -  [Pad_e2711]  29.45 20.91 0 top
NOREF#647  -  [Pad_e2861]  30.72 16.62 0 top
NOREF#648  -  [Pad_e1752]  56.56 56.13 0 top
NOREF#649  -  [Pad_e2762]  29.19 18.64 0 top
NOREF#650  -  [Pad_e2415]  59.06 52.83 0 top
NOREF#651  -  [Pad_e2452]  43.69 22.73 0 top
NOREF#652  -  [Pad_e2737]  30.72 19.91 0 top
NOREF#653  -  [Pad_e3044]  48.39 33.65 0 top
NOREF#654  -  [Pad_e3067]  64.9 20.95 0 top
NOREF#655  -  [Pad_e2015]  60.83 56.9 0 top
NOREF#656  -  [Pad_e2772]  29.7 19.4 0 top
NOREF#657  -  [Pad_e1933]  61.34 57.15 0 top
NOREF#658  -  [Pad_e2954]  47.24 38.23 0 top
NOREF#659  -  [Pad_e323]  53.97 41.78 0 top
NOREF#660  -  [Pad_e3073]  64.01 18.54 0 top
NOREF#661  -  [Pad_e129]  50.93 43.05 0 top
NOREF#662  -  [Pad_e1676]  58.6 52.07 0 top
NOREF#663  -  [Pad_e2465]  43.18 22.73 0 top
NOREF#664  -  [Pad_e2091]  61.59 55.63 0 top
NOREF#665  -  [Pad_e2821]  28.68 17.61 0 top
NOREF#666  -  [Pad_e1691]  58.34 52.58 0 top
NOREF#667  -  [Pad_e2870]  29.7 15.86 0 top
NOREF#668  -  [Pad_e2077]  61.59 58.42 0 top
NOREF#669  -  [Pad_e2799]  30.72 18.37 0 top
NOREF#670  -  [Pad_e1625]  56.82 51.56 0 top
NOREF#671  -  [Pad_e128]  51.18 42.8 0 top
NOREF#672  -  [Pad_e3056]  64.13 20.45 0 top
NOREF#673  -  [Pad_e2879]  28.94 16.37 0 top
NOREF#674  -  [Pad_e2678]  30.97 21.42 0 top
NOREF#675  -  [Pad_e2832]  29.7 18.12 0 top
NOREF#676  -  [Pad_e1522]  58.6 50.55 0 top
NOREF#677  -  [Pad_e2054]  61.09 58.42 0 top
NOREF#678  -  [Pad_e2860]  30.97 16.37 0 top
NOREF#679  -  [Pad_e2479]  44.45 24 0 top
NOREF#680  -  [Pad_e115]  39.18 39.3 0 top
NOREF#681  -  [Pad_e1632]  56.06 50.55 0 top
NOREF#682  -  [Pad_e2564]  44.7 22.22 0 top
NOREF#683  -  [Pad_e1583]  57.83 55.37 0 top
NOREF#684  -  [Pad_e1661]  56.82 52.58 0 top
NOREF#685  -  [Pad_e1816]  60.83 54.1 0 top
NOREF#686  -  [Pad_e1573]  57.07 55.37 0 top
NOREF#687  -  [Pad_e1943]  59.06 55.12 0 top
NOREF#688  -  [Pad_e1531]  57.83 51.05 0 top
NOREF#689  -  [Pad_e2660]  30.97 20.15 0 top
NOREF#690  -  [Pad_e2471]  43.69 23.49 0 top
NOREF#691  -  [Pad_e112]  39.17 41.47 0 top
NOREF#692  -  [Pad_e3041]  48.64 33.65 0 top
NOREF#693  -  [Pad_e1754]  56.56 55.88 0 top
NOREF#694  -  [Pad_e1837]  61.59 54.36 0 top
NOREF#695  -  [Pad_e2608]  30.61 22.61 0 top
NOREF#696  -  [Pad_e2988]  44.75 41.59 0 top
NOREF#697  -  [Pad_e234]  51.69 43.05 0 top
NOREF#698  -  [Pad_e180]  45.21 35.94 0 top
NOREF#699  -  [Pad_e121]  50.67 43.05 0 top
NOREF#700  -  [Pad_e1851]  59.82 54.1 0 top
NOREF#701  -  [Pad_e3059]  64.39 20.45 0 top
NOREF#702  -  [Pad_e2820]  28.68 17.36 0 top
NOREF#703  -  [Pad_e2065]  60.33 57.91 0 top
NOREF#704  -  [Pad_e2490]  44.2 22.73 0 top
NOREF#705  -  [Pad_e1994]  59.31 56.39 0 top
NOREF#706  -  [Pad_e2064]  60.33 57.66 0 top
NOREF#707  -  [Pad_e2092]  61.85 55.12 0 top
NOREF#708  -  [Pad_e2674]  30.46 20.4 0 top
NOREF#709  -  [Pad_e2016]  60.58 56.64 0 top
NOREF#710  -  [Pad_e2975]  45 41.08 0 top
NOREF#711  -  [Pad_e2845]  30.21 16.88 0 top
NOREF#712  -  [Pad_e315]  53.97 42.29 0 top
NOREF#713  -  [Pad_e1683]  57.58 52.58 0 top
NOREF#714  -  [Pad_e2058]  60.83 57.91 0 top
NOREF#715  -  [Pad_e2087]  61.34 54.86 0 top
NOREF#716  -  [Pad_e117]  39.17 38.16 0 top
NOREF#717  -  [Pad_e2619]  30.86 22.86 0 top
NOREF#718  -  [Pad_e311]  53.97 42.8 0 top
NOREF#719  -  [Pad_e1667]  57.33 52.83 0 top
NOREF#720  -  [Pad_e2024]  60.83 56.39 0 top
NOREF#721  -  [Pad_e299]  54.74 42.04 0 top
NOREF#722  -  [Pad_e2838]  29.95 16.62 0 top
NOREF#723  -  [Pad_e2735]  30.21 18.64 0 top
NOREF#724  -  [Pad_e1860]  60.33 58.42 0 top
NOREF#725  -  [Pad_e1600]  57.33 51.82 0 top
NOREF#726  -  [Pad_e330]  54.74 42.54 0 top
NOREF#727  -  [Pad_e2911]  43.81 39.62 0 top
NOREF#728  -  [Pad_e319]  53.47 41.78 0 top
NOREF#729  -  [Pad_e262]  52.45 42.8 0 top
NOREF#730  -  [Pad_e3003]  48.64 34.16 0 top
NOREF#731  -  [Pad_e1654]  56.31 52.58 0 top
NOREF#732  -  [Pad_e1636]  56.56 50.55 0 top
NOREF#733  -  [Pad_e3057]  63.88 20.45 0 top
NOREF#734  -  [Pad_e1988]  59.82 56.64 0 top
NOREF#735  -  [Pad_e3063]  64.64 20.7 0 top
NOREF#736  -  [Pad_e1976]  61.09 55.63 0 top
NOREF#737  -  [Pad_e1894]  61.85 54.61 0 top
NOREF#738  -  [Pad_e275]  52.2 41.78 0 top
NOREF#739  -  [Pad_e2903]  44.07 39.12 0 top
NOREF#740  -  [Pad_e1830]  60.83 53.34 0 top
NOREF#741  -  [Pad_e1975]  61.34 55.88 0 top
NOREF#742  -  [Pad_e3051]  64.13 20.19 0 top
NOREF#743  -  [Pad_e1537]  58.09 51.05 0 top
NOREF#744  -  [Pad_e2062]  61.34 58.67 0 top
NOREF#745  -  [Pad_e1998]  59.82 56.39 0 top
NOREF#746  -  [Pad_e1736]  57.83 53.59 0 top
NOREF#747  -  [Pad_e1811]  61.85 53.34 0 top
NOREF#748  -  [Pad_e107]  44.62 44.27 0 top
NOREF#749  -  [Pad_e2605]  30.35 22.86 0 top
NOREF#750  -  [Pad_e1596]  58.09 54.61 0 top
NOREF#751  -  [Pad_e3050]  64.9 20.19 0 top
NOREF#752  -  [Pad_e1715]  57.07 54.1 0 top
NOREF#753  -  [Pad_e2451]  43.94 22.99 0 top
NOREF#754  -  [Pad_e1997]  59.56 56.39 0 top
NOREF#755  -  [Pad_e2826]  29.7 18.37 0 top
NOREF#756  -  [Pad_e265]  52.71 42.54 0 top
NOREF#757  -  [Pad_e2775]  29.95 18.63 0 top
NOREF#758  -  [Pad_e2899]  43.81 38.86 0 top
NOREF#759  -  [Pad_e163]  45.72 60.32 0 top
NOREF#760  -  [Pad_e1759]  56.31 54.86 0 top
NOREF#761  -  [Pad_e1789]  58.6 55.63 0 top
NOREF#762  -  [Pad_e1554]  58.85 51.05 0 top
NOREF#763  -  [Pad_e1693]  56.06 54.36 0 top
NOREF#764  -  [Pad_e2986]  44.24 41.59 0 top
NOREF#765  -  [Pad_e1914]  59.56 54.1 0 top
NOREF#766  -  [Pad_e2682]  30.97 20.91 0 top
NOREF#767  -  [Pad_e3113]  56.52 20.57 0 top
NOREF#768  -  [Pad_e1885]  61.34 57.4 0 top
NOREF#769  -  [Pad_e2532]  43.94 21.97 0 top
NOREF#770  -  [Pad_e3109]  56.26 20.32 0 top
NOREF#771  -  [Pad_e2047]  59.31 57.66 0 top
NOREF#772  -  [Pad_e2072]  61.85 58.67 0 top
NOREF#773  -  [Pad_e2700]  28.68 20.15 0 top
NOREF#774  -  [Pad_e113]  39.18 40.95 0 top
NOREF#775  -  [Pad_e1783]  58.34 55.12 0 top
NOREF#776  -  [Pad_e1792]  57.33 53.34 0 top
NOREF#777  -  [Pad_e2068]  61.34 58.17 0 top
NOREF#778  -  [Pad_e2598]  30.1 22.61 0 top
NOREF#779  -  [Pad_e2729]  30.21 19.15 0 top
NOREF#780  -  [Pad_e2418]  59.06 52.32 0 top
NOREF#781  -  [Pad_e1873]  60.83 58.42 0 top
NOREF#782  -  [Pad_e2662]  30.72 20.15 0 top
NOREF#783  -  [Pad_e2684]  30.46 21.16 0 top
NOREF#784  -  [Pad_e2659]  30.21 21.42 0 top
NOREF#785  -  [Pad_e2534]  43.43 22.22 0 top
NOREF#786  -  [Pad_e2698]  29.19 20.91 0 top
NOREF#787  -  [Pad_e284]  52.71 41.78 0 top
NOREF#788  -  [Pad_e3112]  55.75 20.57 0 top
NOREF#789  -  [Pad_e1934]  60.07 54.86 0 top
NOREF#790  -  [Pad_e2983]  44.75 41.33 0 top
NOREF#791  -  [Pad_e116]  39.17 38.66 0 top
NOREF#792  -  [Pad_e2828]  29.7 18.63 0 top
NOREF#793  -  [Pad_e1617]  56.31 51.56 0 top
NOREF#794  -  [Pad_e2874]  29.19 17.13 0 top
NOREF#795  -  [Pad_e1602]  56.31 51.82 0 top
NOREF#796  -  [Pad_e2905]  44.58 39.37 0 top
NOREF#797  -  [Pad_e1979]  61.34 55.37 0 top
NOREF#798  -  [Pad_e1760]  56.06 55.12 0 top
NOREF#799  -  [Pad_e2059]  60.58 57.66 0 top
NOREF#800  -  [Pad_e2618]  31.12 23.11 0 top
NOREF#801  -  [Pad_e2892]  29.7 16.62 0 top
NOREF#802  -  [Pad_e2042]  59.56 58.67 0 top
NOREF#803  -  [Pad_e3027]  48.13 32.89 0 top
NOREF#804  -  [Pad_e1563]  56.82 51.31 0 top
NOREF#805  -  [Pad_e1639]  57.33 51.31 0 top
NOREF#806  -  [Pad_e41]  50.16 40 0 top
NOREF#807  -  [Pad_e1749]  56.06 55.63 0 top
NOREF#808  -  [Pad_e2985]  45 41.59 0 top
NOREF#809  -  [Pad_e2889]  29.45 16.88 0 top
NOREF#810  -  [Pad_e1906]  59.06 54.1 0 top
NOREF#811  -  [Pad_e3054]  64.64 20.19 0 top
NOREF#812  -  [Pad_e1590]  56.56 54.61 0 top
NOREF#813  -  [Pad_e2981]  44.24 41.33 0 top
NOREF#814  -  [Pad_e2612]  30.61 21.84 0 top
NOREF#815  -  [Pad_e1996]  59.82 56.13 0 top
NOREF#816  -  [Pad_e2007]  61.85 56.13 0 top
NOREF#817  -  [Pad_e3111]  56.01 20.57 0 top
NOREF#818  -  [Pad_e2740]  30.97 19.15 0 top
NOREF#819  -  [Pad_e183]  47.5 41.02 0 top
NOREF#820  -  [Pad_e2926]  46.74 36.96 0 top
NOREF#821  -  [Pad_e232]  51.69 42.8 0 top
NOREF#822  -  [Pad_e1572]  57.33 55.63 0 top
NOREF#823  -  [Pad_e2509]  43.18 22.48 0 top
NOREF#824  -  [Pad_e2545]  44.45 22.22 0 top
NOREF#825  -  [Pad_e2869]  28.94 17.13 0 top
NOREF#826  -  [Pad_e2538]  44.2 21.97 0 top
NOREF#827  -  [Pad_e1692]  57.07 53.34 0 top
NOREF#828  -  [Pad_e2513]  43.69 21.46 0 top
NOREF#829  -  [Pad_e3087]  64.01 19.3 0 top
NOREF#830  -  [Pad_e3004]  48.9 34.16 0 top
NOREF#831  -  [Pad_e1843]  61.59 53.59 0 top
NOREF#832  -  [Pad_e2707]  29.45 21.42 0 top
NOREF#833  -  [Pad_e2978]  44.5 41.08 0 top
NOREF#834  -  [Pad_e181]  50.93 42.29 0 top
NOREF#835  -  [Pad_e3075]  65.02 18.8 0 top
NOREF#836  -  [Pad_e1541]  57.58 50.55 0 top
NOREF#837  -  [Pad_e2000]  60.33 57.15 0 top
NOREF#838  -  [Pad_e2037]  59.06 58.42 0 top
NOREF#839  -  [Pad_e1892]  59.82 54.61 0 top
NOREF#840  -  [Pad_e2919]  43.81 39.88 0 top
NOREF#841  -  [Pad_e1954]  59.82 54.86 0 top
NOREF#842  -  [Pad_e2788]  30.46 18.12 0 top
NOREF#843  -  [Pad_e2461]  42.93 22.99 0 top
NOREF#844  -  [Pad_e1866]  61.59 57.66 0 top
NOREF#845  -  [Pad_e2069]  61.34 58.42 0 top
NOREF#846  -  [Pad_e2731]  29.95 18.9 0 top
NOREF#847  -  [Pad_e1840]  61.85 53.59 0 top
NOREF#848  -  [Pad_e1863]  61.85 57.66 0 top
NOREF#849  -  [Pad_e2758]  29.19 19.4 0 top
NOREF#850  -  [Pad_e2751]  29.7 18.9 0 top
NOREF#851  -  [Pad_e2725]  30.21 19.66 0 top
NOREF#852  -  [Pad_e1922]  59.06 53.09 0 top
NOREF#853  -  [Pad_e3107]  55.75 20.32 0 top
NOREF#854  -  [Pad_e3024]  48.39 32.64 0 top
NOREF#855  -  [Pad_e2041]  59.82 58.93 0 top
NOREF#856  -  [Pad_e2756]  29.19 19.15 0 top
NOREF#857  -  [Pad_e15]  48.19 55.9 0 top
NOREF#858  -  [Pad_e1833]  61.09 53.34 0 top
NOREF#859  -  [Pad_e1980]  60.07 56.13 0 top
NOREF#860  -  [Pad_e1587]  58.09 56.13 0 top
NOREF#861  -  [Pad_e2677]  30.72 21.42 0 top
NOREF#862  -  [Pad_e2835]  29.95 17.13 0 top
NOREF#863  -  [Pad_e2974]  44.24 40.82 0 top
NOREF#864  -  [Pad_e1879]  59.82 57.4 0 top
NOREF#865  -  [Pad_e2990]  44.75 41.84 0 top
NOREF#866  -  [Pad_e1953]  59.56 54.86 0 top
NOREF#867  -  [Pad_e1990]  59.82 56.9 0 top
NOREF#868  -  [Pad_e2602]  30.86 21.84 0 top
NOREF#869  -  [Pad_e1642]  58.6 54.1 0 top
NOREF#870  -  [Pad_e2952]  46.48 38.23 0 top
NOREF#871  -  [Pad_e1725]  57.83 53.85 0 top
NOREF#872  -  [Pad_e2849]  30.21 16.37 0 top
NOREF#873  -  [Pad_e3106]  56.01 20.32 0 top
NOREF#874  -  [Pad_e1734]  57.83 53.34 0 top
NOREF#875  -  [Pad_e2693]  29.45 20.4 0 top
NOREF#876  -  [Pad_e1852]  59.82 57.91 0 top
NOREF#877  -  [Pad_e127]  50.42 42.29 0 top
NOREF#878  -  [Pad_e2791]  29.95 17.61 0 top
NOREF#879  -  [Pad_e1650]  56.06 52.83 0 top
NOREF#880  -  [Pad_e2852]  30.46 15.86 0 top
NOREF#881  -  [Pad_e1540]  57.83 50.29 0 top
NOREF#882  -  [Pad_e2596]  30.1 22.86 0 top
NOREF#883  -  [Pad_e3060]  64.9 20.7 0 top
NOREF#884  -  [Pad_e156]  50.93 42.54 0 top
NOREF#885  -  [Pad_e1607]  58.6 51.82 0 top
NOREF#886  -  [Pad_e1647]  57.33 52.07 0 top
NOREF#887  -  [Pad_e239]  51.44 42.29 0 top
NOREF#888  -  [Pad_e289]  52.96 43.05 0 top
NOREF#889  -  [Pad_e2752]  29.45 18.64 0 top
NOREF#890  -  [Pad_e1711]  56.56 53.34 0 top
NOREF#891  -  [Pad_e2017]  61.09 57.15 0 top
NOREF#892  -  [Pad_e1547]  58.09 50.29 0 top
NOREF#893  -  [Pad_e233]  51.44 43.05 0 top
NOREF#894  -  [Pad_e36]  50.16 40.51 0 top
NOREF#895  -  [Pad_e2900]  44.58 39.12 0 top
NOREF#896  -  [Pad_e1999]  59.56 56.13 0 top
NOREF#897  -  [Pad_e2918]  43.56 39.88 0 top
NOREF#898  -  [Pad_e2882]  29.19 15.86 0 top
NOREF#899  -  [Pad_e2476]  44.2 23.75 0 top
NOREF#900  -  [Pad_e2004]  60.33 56.9 0 top
NOREF#901  -  [Pad_e1644]  58.6 53.85 0 top
NOREF#902  -  [Pad_e1883]  60.83 57.4 0 top
NOREF#903  -  [Pad_e2824]  29.19 17.61 0 top
NOREF#904  -  [Pad_e2666]  30.46 20.65 0 top
NOREF#905  -  [Pad_e1959]  60.33 55.12 0 top
NOREF#906  -  [Pad_e1819]  60.83 53.85 0 top
NOREF#907  -  [Pad_e2836]  29.95 16.88 0 top
NOREF#908  -  [Pad_e2044]  59.56 58.42 0 top
NOREF#909  -  [Pad_e1803]  58.6 52.83 0 top
NOREF#910  -  [Pad_e2948]  46.48 37.97 0 top
NOREF#911  -  [Pad_e1898]  61.34 54.61 0 top
NOREF#912  -  [Pad_e2701]  28.68 20.4 0 top
NOREF#913  -  [Pad_e1569]  57.07 55.88 0 top
NOREF#914  -  [Pad_e1620]  56.31 50.8 0 top
NOREF#915  -  [Pad_e2706]  29.7 21.16 0 top
NOREF#916  -  [Pad_e3086]  64.26 19.3 0 top
NOREF#917  -  [Pad_e1678]  57.58 53.09 0 top
NOREF#918  -  [Pad_e3099]  56.01 19.81 0 top
NOREF#919  -  [Pad_e2703]  28.94 20.4 0 top
NOREF#920  -  [Pad_e3034]  48.64 33.15 0 top
NOREF#921  -  [Pad_e2020]  61.34 56.9 0 top
NOREF#922  -  [Pad_e2501]  44.96 23.49 0 top
NOREF#923  -  [Pad_e185]  50.67 41.78 0 top
NOREF#924  -  [Pad_e2989]  44.5 41.59 0 top
NOREF#925  -  [Pad_e2901]  43.81 39.12 0 top
NOREF#926  -  [Pad_e1864]  61.59 57.91 0 top
NOREF#927  -  [Pad_e2705]  28.94 20.15 0 top
NOREF#928  -  [Pad_e327]  54.48 42.8 0 top
NOREF#929  -  [Pad_e1876]  59.06 57.4 0 top
NOREF#930  -  [Pad_e2993]  43.99 41.84 0 top
NOREF#931  -  [Pad_e2484]  44.7 24 0 top
NOREF#932  -  [Pad_e2483]  44.96 22.99 0 top
NOREF#933  -  [Pad_e1888]  60.33 54.61 0 top
NOREF#934  -  [Pad_e1631]  56.31 50.29 0 top
NOREF#935  -  [Pad_e2712]  29.7 20.91 0 top
NOREF#936  -  [Pad_e136]  51.18 42.29 0 top
NOREF#937  -  [Pad_e2996]  48.64 33.91 0 top
NOREF#938  -  [Pad_e2436]  60.07 52.58 0 top
NOREF#939  -  [Pad_e2766]  29.7 19.66 0 top
NOREF#940  -  [Pad_e2494]  44.7 22.99 0 top
NOREF#941  -  [Pad_e2769]  29.45 19.66 0 top
NOREF#942  -  [Pad_e2822]  29.19 17.36 0 top
NOREF#943  -  [Pad_e1951]  59.06 54.86 0 top
NOREF#944  -  [Pad_e224]  50.93 41.78 0 top
NOREF#945  -  [Pad_e259]  51.94 42.29 0 top
NOREF#946  -  [Pad_e291]  52.96 42.8 0 top
NOREF#947  -  [Pad_e2854]  30.46 16.11 0 top
NOREF#948  -  [Pad_e2942]  47.5 37.72 0 top
NOREF#949  -  [Pad_e1542]  57.83 50.55 0 top
NOREF#950  -  [Pad_e1763]  56.82 54.86 0 top
NOREF#951  -  [Pad_e182]  42.29 41.66 0 top
NOREF#952  -  [Pad_e1528]  57.83 51.31 0 top
NOREF#953  -  [Pad_e1919]  59.31 53.09 0 top
NOREF#954  -  [Pad_e1606]  58.85 51.82 0 top
NOREF#955  -  [Pad_e2535]  44.2 22.48 0 top
NOREF#956  -  [Pad_e1626]  56.56 51.31 0 top
NOREF#957  -  [Pad_e114]  39.19 40.13 0 top
NOREF#958  -  [Pad_e1622]  56.31 51.05 0 top
NOREF#959  -  [Pad_e1779]  58.34 56.13 0 top
NOREF#960  -  [Pad_e2880]  28.68 15.86 0 top
NOREF#961  -  [Pad_e3036]  48.39 33.4 0 top
NOREF#962  -  [Pad_e1884]  61.09 57.4 0 top
NOREF#963  -  [Pad_e2792]  30.46 17.36 0 top
NOREF#964  -  [Pad_e1986]  59.06 56.64 0 top
NOREF#965  -  [Pad_e1823]  61.09 54.1 0 top
NOREF#966  -  [Pad_e2815]  28.94 18.37 0 top
NOREF#967  -  [Pad_e1780]  58.34 55.37 0 top
NOREF#968  -  [Pad_e2051]  59.82 57.66 0 top
NOREF#969  -  [Pad_e2503]  44.96 23.24 0 top
NOREF#970  -  [Pad_e2464]  43.43 22.99 0 top
NOREF#971  -  [Pad_e1656]  56.56 53.09 0 top
NOREF#972  -  [Pad_e1574]  56.82 55.88 0 top
NOREF#973  -  [Pad_e2759]  28.94 19.15 0 top
NOREF#974  -  [Pad_e47]  50.16 37.46 0 top
NOREF#975  -  [Pad_e49]  50.16 36.45 0 top
NOREF#976  -  [Pad_e1766]  58.09 55.63 0 top
NOREF#977  -  [Pad_e1538]  58.34 51.05 0 top
NOREF#978  -  [Pad_e2873]  29.45 16.11 0 top
NOREF#979  -  [Pad_e2478]  44.2 23.49 0 top
NOREF#980  -  [Pad_e1949]  59.82 55.37 0 top
NOREF#981  -  [Pad_e1785]  58.6 56.13 0 top
NOREF#982  -  [Pad_e1872]  60.58 58.42 0 top
NOREF#983  -  [Pad_e3095]  56.77 19.81 0 top
NOREF#984  -  [Pad_e2467]  43.69 24 0 top
NOREF#985  -  [Pad_e1775]  58.6 54.36 0 top
NOREF#986  -  [Pad_e1820]  60.58 53.59 0 top
NOREF#987  -  [Pad_e1786]  58.85 56.13 0 top
NOREF#988  -  [Pad_e1800]  58.85 52.83 0 top
NOREF#989  -  [Pad_e2426]  59.56 52.07 0 top
NOREF#990  -  [Pad_e3053]  64.39 20.19 0 top
NOREF#991  -  [Pad_e1984]  59.06 56.9 0 top
NOREF#992  -  [Pad_e1712]  57.33 54.36 0 top
NOREF#993  -  [Pad_e2036]  59.31 58.17 0 top
NOREF#994  -  [Pad_e296]  52.71 42.8 0 top
NOREF#995  -  [Pad_e2679]  30.72 21.16 0 top
NOREF#996  -  [Pad_e1627]  56.82 50.8 0 top
NOREF#997  -  [Pad_e2003]  60.07 56.9 0 top
NOREF#998  -  [Pad_e2544]  44.7 22.48 0 top
NOREF#999  -  [Pad_e2473]  43.69 23.24 0 top
NOREF#1000  -  [Pad_e1560]  57.07 51.05 0 top
NOREF#1001  -  [Pad_e3102]  55.75 20.07 0 top
NOREF#1002  -  [Pad_e2026]  61.34 56.13 0 top
NOREF#1003  -  [Pad_e2438]  60.07 52.83 0 top
NOREF#1004  -  [Pad_e2776]  29.95 18.37 0 top
NOREF#1005  -  [Pad_e2796]  30.97 18.37 0 top
NOREF#1006  -  [Pad_e2823]  28.94 17.61 0 top
NOREF#1007  -  [Pad_e1741]  58.09 53.34 0 top
NOREF#1008  -  [Pad_e314]  54.23 42.54 0 top
NOREF#1009  -  [Pad_e1849]  60.33 53.85 0 top
NOREF#1010  -  [Pad_e2579]  29.08 22.35 0 top
NOREF#1011  -  [Pad_e2858]  30.97 17.13 0 top
NOREF#1012  -  [Pad_e2795]  30.21 17.36 0 top
NOREF#1013  -  [Pad_e2802]  30.97 18.12 0 top
NOREF#1014  -  [Pad_e2448]  42.93 23.49 0 top
NOREF#1015  -  [Pad_e2760]  28.68 18.64 0 top
NOREF#1016  -  [Pad_e2423]  59.82 51.82 0 top
NOREF#1017  -  [Pad_e2945]  47.5 37.97 0 top
NOREF#1018  -  [Pad_e261]  52.71 43.05 0 top
NOREF#1019  -  [Pad_e1687]  58.34 53.09 0 top
NOREF#1020  -  [Pad_e3093]  64.01 19.56 0 top
NOREF#1021  -  [Pad_e3104]  56.52 20.07 0 top
NOREF#1022  -  [Pad_e2090]  61.85 55.88 0 top
NOREF#1023  -  [Pad_e134]  51.18 43.05 0 top
NOREF#1024  -  [Pad_e2560]  45.21 21.72 0 top
NOREF#1025  -  [Pad_e3069]  64.13 20.95 0 top
NOREF#1026  -  [Pad_e46]  50.16 37.97 0 top
NOREF#1027  -  [Pad_e2435]  59.31 51.56 0 top
NOREF#1028  -  [Pad_e3008]  48.9 34.42 0 top
NOREF#1029  -  [Pad_e1795]  58.09 52.32 0 top
NOREF#1030  -  [Pad_e63]  47.24 30.99 0 top
NOREF#1031  -  [Pad_e283]  51.94 41.78 0 top
NOREF#1032  -  [Pad_e2506]  42.93 22.22 0 top
NOREF#1033  -  [Pad_e1974]  61.09 55.88 0 top
NOREF#1034  -  [Pad_e2482]  44.96 22.73 0 top
NOREF#1035  -  [Pad_e3070]  65.02 18.54 0 top
NOREF#1036  -  [Pad_e3049]  64.13 19.94 0 top
NOREF#1037  -  [Pad_e2906]  43.81 39.37 0 top
NOREF#1038  -  [Pad_e3079]  64.77 18.8 0 top
NOREF#1039  -  [Pad_e2953]  46.99 38.23 0 top
NOREF#1040  -  [Pad_e2867]  28.68 16.37 0 top
NOREF#1041  -  [Pad_e1527]  57.58 51.31 0 top
NOREF#1042  -  [Pad_e1603]  56.06 51.82 0 top
NOREF#1043  -  [Pad_e2850]  29.95 15.86 0 top
NOREF#1044  -  [Pad_e2520]  42.93 21.21 0 top
NOREF#1045  -  [Pad_e1696]  56.06 54.1 0 top
NOREF#1046  -  [Pad_e3078]  64.52 18.8 0 top
NOREF#1047  -  [Pad_e2597]  30.1 22.35 0 top
NOREF#1048  -  [Pad_e1673]  57.33 52.58 0 top
NOREF#1049  -  [Pad_e1846]  60.07 54.1 0 top
NOREF#1050  -  [Pad_e1931]  61.85 56.9 0 top
NOREF#1051  -  [Pad_e3062]  63.88 20.7 0 top
NOREF#1052  -  [Pad_e1924]  59.56 53.34 0 top
NOREF#1053  -  [Pad_e1790]  58.85 55.63 0 top
NOREF#1054  -  [Pad_e2585]  29.08 21.84 0 top
NOREF#1055  -  [Pad_e1899]  61.09 54.61 0 top
NOREF#1056  -  [Pad_e1705]  56.06 53.59 0 top
NOREF#1057  -  [Pad_e2847]  30.21 16.62 0 top
NOREF#1058  -  [Pad_e2680]  30.97 20.65 0 top
NOREF#1059  -  [Pad_e1539]  58.09 50.8 0 top
NOREF#1060  -  [Pad_e240]  51.69 41.78 0 top
NOREF#1061  -  [Pad_e1570]  57.33 55.37 0 top
NOREF#1062  -  [Pad_e44]  50.16 38.48 0 top
NOREF#1063  -  [Pad_e2998]  48.13 33.91 0 top
NOREF#1064  -  [Pad_e1925]  59.82 53.34 0 top
NOREF#1065  -  [Pad_e2778]  29.95 18.12 0 top
NOREF#1066  -  [Pad_e1945]  59.82 55.88 0 top
NOREF#1067  -  [Pad_e1605]  56.56 51.82 0 top
NOREF#1068  -  [Pad_e1581]  57.58 55.88 0 top
NOREF#1069  -  [Pad_e2907]  43.56 39.37 0 top
NOREF#1070  -  [Pad_e1865]  61.85 57.91 0 top
NOREF#1071  -  [Pad_e3082]  64.01 19.05 0 top
NOREF#1072  -  [Pad_e2089]  61.59 55.88 0 top
NOREF#1073  -  [Pad_e2591]  29.59 22.61 0 top
NOREF#1074  -  [Pad_e2939]  46.99 37.46 0 top
NOREF#1075  -  [Pad_e1680]  57.58 52.83 0 top
NOREF#1076  -  [Pad_e1549]  58.6 51.56 0 top
NOREF#1077  -  [Pad_e1652]  56.31 52.32 0 top
NOREF#1078  -  [Pad_e1668]  57.07 53.09 0 top
NOREF#1079  -  [Pad_e2958]  47.24 38.48 0 top
NOREF#1080  -  [Pad_e317]  53.47 42.04 0 top
NOREF#1081  -  [Pad_e1768]  57.83 54.86 0 top
NOREF#1082  -  [Pad_e2039]  59.06 58.17 0 top
NOREF#1083  -  [Pad_e2897]  44.32 38.86 0 top
NOREF#1084  -  [Pad_e2671]  29.95 20.4 0 top
NOREF#1085  -  [Pad_e2078]  61.85 58.42 0 top
NOREF#1086  -  [Pad_e1653]  56.06 52.58 0 top
NOREF#1087  -  [Pad_e2657]  29.95 20.65 0 top
NOREF#1088  -  [Pad_e2727]  30.21 19.4 0 top

## Routing (per net, layer and track width the routed paths; a pad name or vN(x,y) marks a point on that pad's centre or on a via; arc(x,y) is an arc through that point)
$3N1161: length 18.2
  Top Layer w0.2: J1.3 40.25,53.99 U1.37
$3N1166: length 21.9
  Top Layer w0.2: J1.2 38.74,58.6 40.08,59.94 42.16,59.94 43.31,58.8 43.31,55.37 42.29,54.36 42.29,44.09 42.75,43.63
$3N1678: length 18.7
  Top Layer w0.2: X2.1 39.92,23.06 39.92,17.28 ; U1.5 43.75,28.13 39.24,23.62
$3N1684: length 18.5
  Top Layer w0.2: U1.6 44.25,28.27 48.51,24 ; X2.2 48.77,17.08 C4.2
$3N2120: length 14.8
  Top Layer w0.2: U1.7 44.75,32.6 53.85,23.49
